# EAGLE design nedonand3 (EAGLE 5.12)
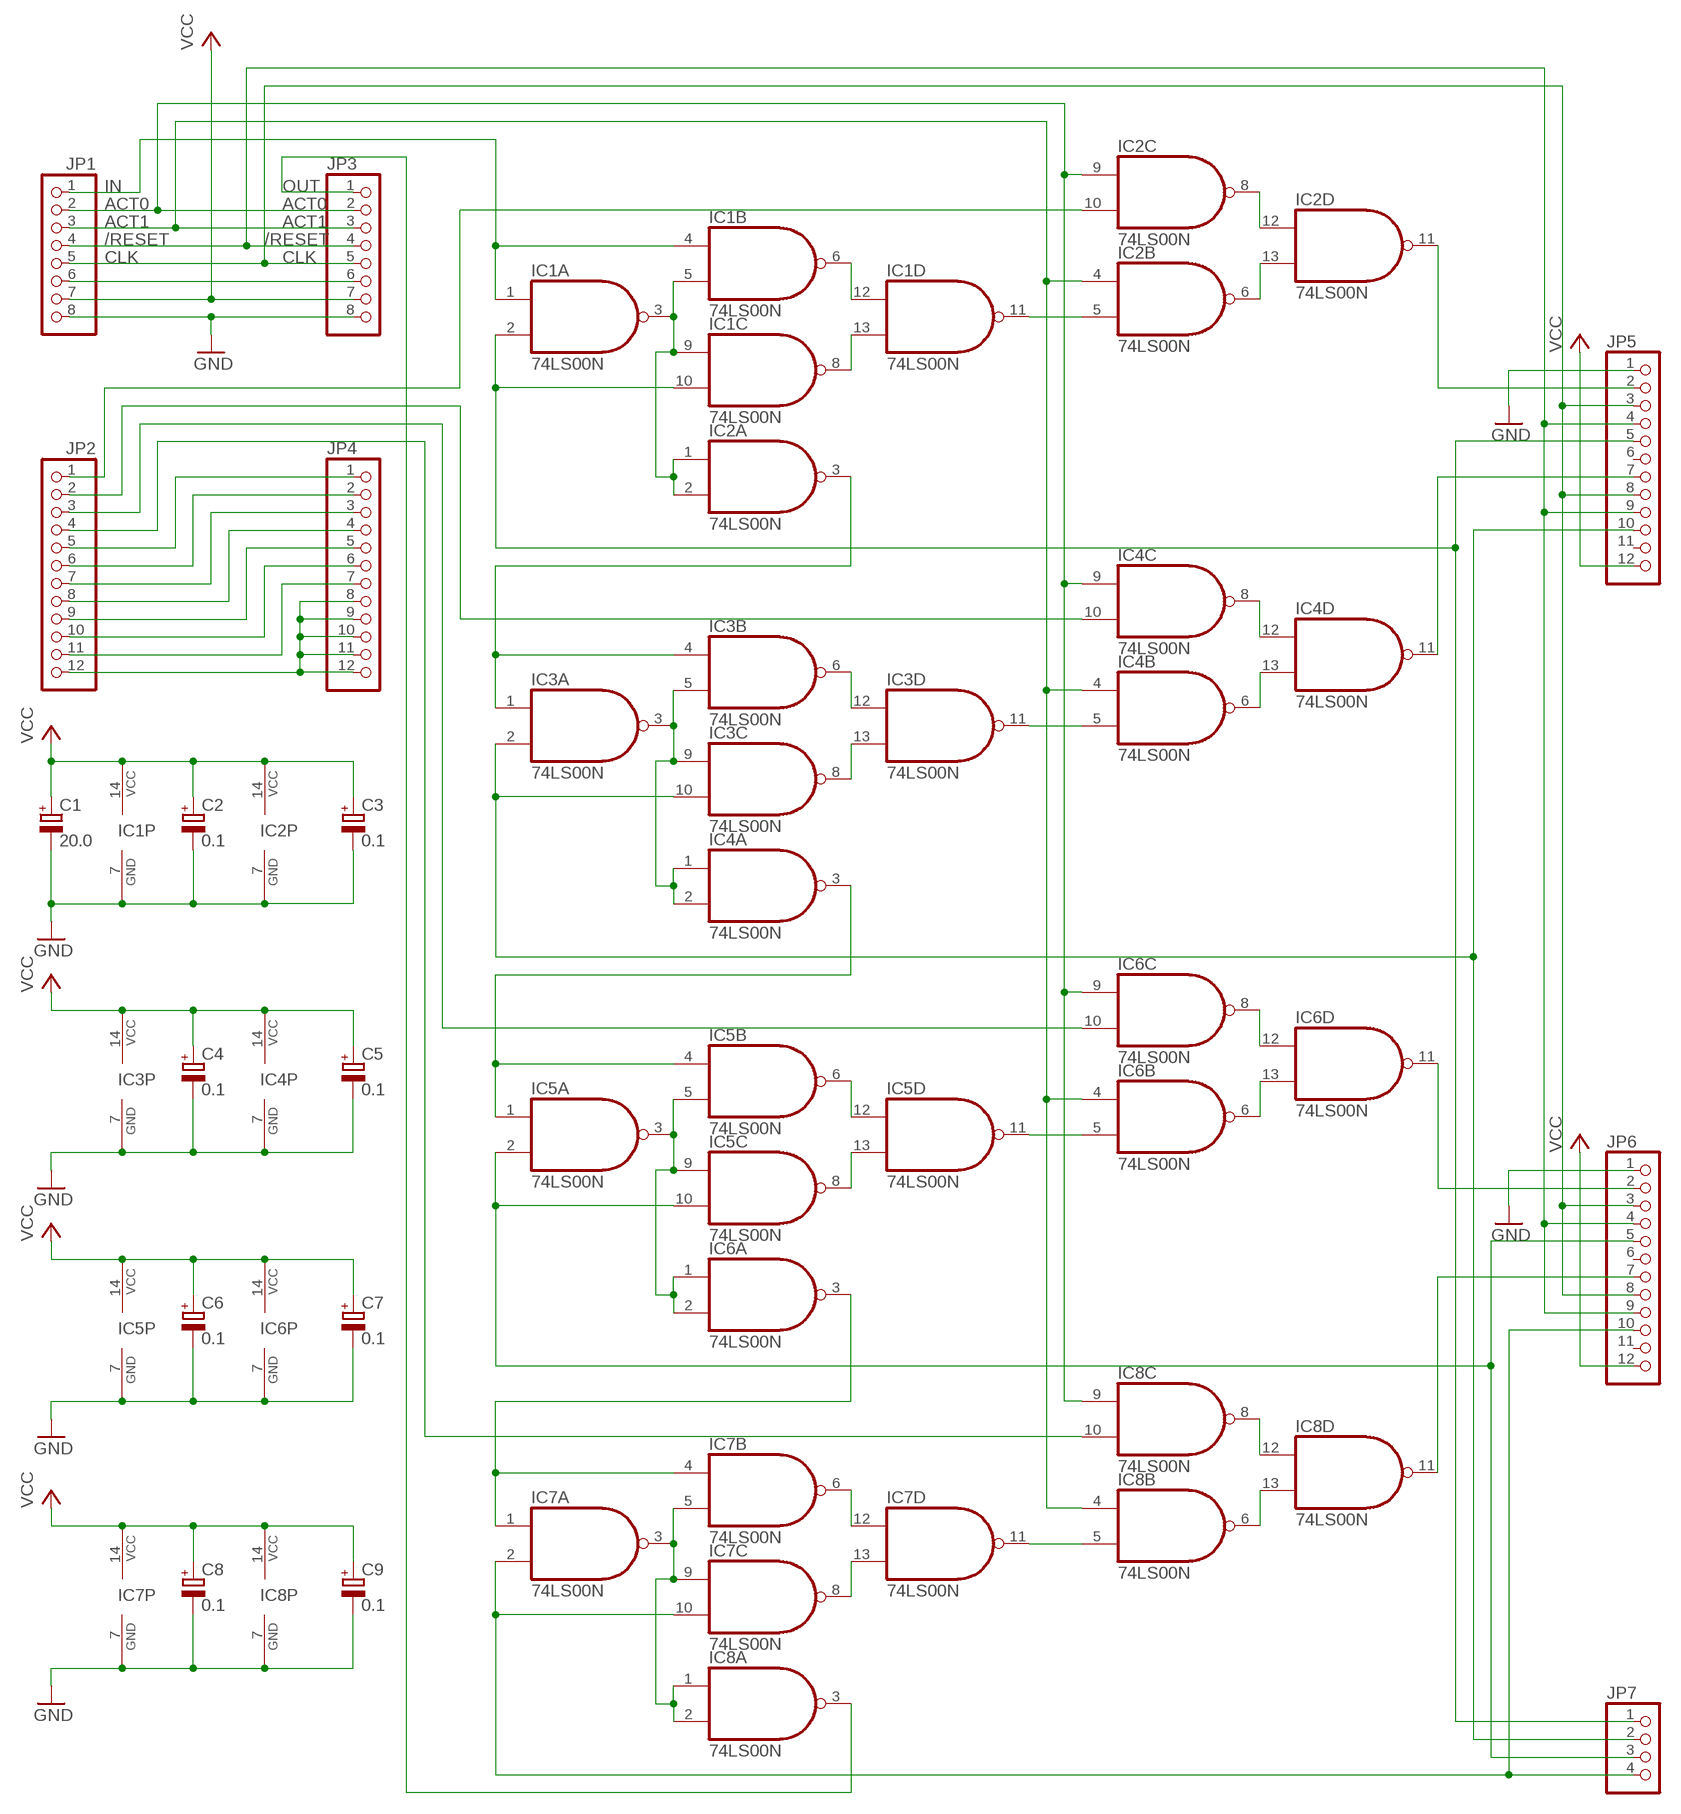
[diagram p0: schematic, sheet 1]

## Parts
C1  20.0  CPOL-EUE2,5-6E  [E2,5-6E]
C2  0.1  CPOL-EUB45181A  [B45181A]
C3  0.1  CPOL-EUB45181A  [B45181A]
C4  0.1  CPOL-EUB45181A  [B45181A]
C5  0.1  CPOL-EUB45181A  [B45181A]
C6  0.1  CPOL-EUB45181A  [B45181A]
C7  0.1  CPOL-EUB45181A  [B45181A]
C8  0.1  CPOL-EUB45181A  [B45181A]
C9  0.1  CPOL-EUB45181A  [B45181A]
IC1  74LS00N  [DIL14]
IC2  74LS00N  [DIL14]
IC3  74LS00N  [DIL14]
IC4  74LS00N  [DIL14]
IC5  74LS00N  [DIL14]
IC6  74LS00N  [DIL14]
IC7  74LS00N  [DIL14]
IC8  74LS00N  [DIL14]
JP1  PINHD-1X8/90  [1X08/90]
JP2  PINHD-1X12/90  [1X12/90]
JP3  PINHD-1X8  [1X08]
JP4  PINHD-1X12  [1X12]
JP5  PINHD-1X12  [1X12]
JP6  PINHD-1X12  [1X12]
JP7  PINHD-1X4  [1X04]

## Nets
/RESET: JP1.4 JP3.4 JP5.4 JP5.9 JP6.4 JP6.9
ACT0: IC2.9(C:I0) IC4.9(C:I0) IC6.9(C:I0) IC8.9(C:I0) JP1.2 JP3.2
ACT1: IC2.4(B:I0) IC4.4(B:I0) IC6.4(B:I0) IC8.4(B:I0) JP1.3 JP3.3
CLK: JP1.5 JP3.5 JP5.3 JP5.8 JP6.3 JP6.8
GND: C1.- C2.- C3.- C4.- C5.- C6.- C7.- C8.- C9.- IC1.7(P:GND) IC2.7(P:GND) IC3.7(P:GND) IC4.7(P:GND) IC5.7(P:GND) IC6.7(P:GND) IC7.7(P:GND) IC8.7(P:GND) JP1.8 JP3.8 JP5.1 JP6.1
IN: IC1.1(A:I0) IC1.4(B:I0) JP1.1
N$1: IC1.3(A:O) IC1.5(B:I1) IC1.9(C:I0) IC2.1(A:I0) IC2.2(A:I1)
N$2: IC1.2(A:I1) IC1.10(C:I1) JP5.5 JP7.1
N$3: IC3.3(A:O) IC3.5(B:I1) IC3.9(C:I0) IC4.1(A:I0) IC4.2(A:I1)
N$4: IC1.6(B:O) IC1.12(D:I0)
N$5: IC1.8(C:O) IC1.13(D:I1)
N$6: IC1.11(D:O) IC2.5(B:I1)
N$7: IC2.6(B:O) IC2.13(D:I1)
N$8: IC2.8(C:O) IC2.12(D:I0)
N$9: JP1.6 JP3.6
N$10: IC3.2(A:I1) IC3.10(C:I1) JP5.10 JP7.2
N$11: IC2.10(C:I1) JP2.1
N$12: IC3.6(B:O) IC3.12(D:I0)
N$13: IC3.8(C:O) IC3.13(D:I1)
N$14: IC4.10(C:I1) JP2.2
N$15: IC6.10(C:I1) JP2.3
N$16: IC8.10(C:I1) JP2.4
N$17: JP2.5 JP4.1
N$18: JP2.6 JP4.2
N$19: JP2.7 JP4.3
N$20: JP2.8 JP4.4
N$21: JP2.9 JP4.5
N$22: JP2.10 JP4.6
N$23: JP2.11 JP4.7
N$24: JP2.12 JP4.8 JP4.9 JP4.10 JP4.11 JP4.12
N$25: IC3.11(D:O) IC4.5(B:I1)
N$26: IC4.6(B:O) IC4.13(D:I1)
N$27: IC4.8(C:O) IC4.12(D:I0)
N$28: IC6.11(D:O) JP6.2
N$29: IC5.3(A:O) IC5.5(B:I1) IC5.9(C:I0) IC6.1(A:I0) IC6.2(A:I1)
N$30: IC5.2(A:I1) IC5.10(C:I1) JP6.5 JP7.3
N$31: IC5.6(B:O) IC5.12(D:I0)
N$32: IC5.8(C:O) IC5.13(D:I1)
N$33: IC5.11(D:O) IC6.5(B:I1)
N$34: IC6.6(B:O) IC6.13(D:I1)
N$35: IC6.8(C:O) IC6.12(D:I0)
N$36: IC2.11(D:O) JP5.2
N$37: IC7.3(A:O) IC7.5(B:I1) IC7.9(C:I0) IC8.1(A:I0) IC8.2(A:I1)
N$38: IC7.2(A:I1) IC7.10(C:I1) JP6.10 JP7.4
N$39: IC7.6(B:O) IC7.12(D:I0)
N$40: IC7.8(C:O) IC7.13(D:I1)
N$41: IC7.11(D:O) IC8.5(B:I1)
N$42: IC8.6(B:O) IC8.13(D:I1)
N$43: IC8.8(C:O) IC8.12(D:I0)
N$44: IC4.11(D:O) JP5.7
N$45: IC2.3(A:O) IC3.1(A:I0) IC3.4(B:I0)
N$46: IC8.11(D:O) JP6.7
N$47: IC4.3(A:O) IC5.1(A:I0) IC5.4(B:I0)
N$48: IC6.3(A:O) IC7.1(A:I0) IC7.4(B:I0)
OUT: IC8.3(A:O) JP3.1
VCC: C1.+ C2.+ C3.+ C4.+ C5.+ C6.+ C7.+ C8.+ C9.+ IC1.14(P:VCC) IC2.14(P:VCC) IC3.14(P:VCC) IC4.14(P:VCC) IC5.14(P:VCC) IC6.14(P:VCC) IC7.14(P:VCC) IC8.14(P:VCC) JP1.7 JP3.7 JP5.12 JP6.12
Unconnected: JP5.6 JP5.11 JP6.6 JP6.11

## Library data of the parts
C1-C9 = rcl:CPOL-EU: POLARIZED CAPACITOR, European symbol
IC1-IC8 = 74xx-us:74*00: Quad 2-input NAND gate
JP1 JP3 = pinhead:PINHD-1X8: PIN HEADER
JP2 JP4-JP6 = pinhead:PINHD-1X12: PIN HEADER
JP7 = pinhead:PINHD-1X4: PIN HEADER

## Board
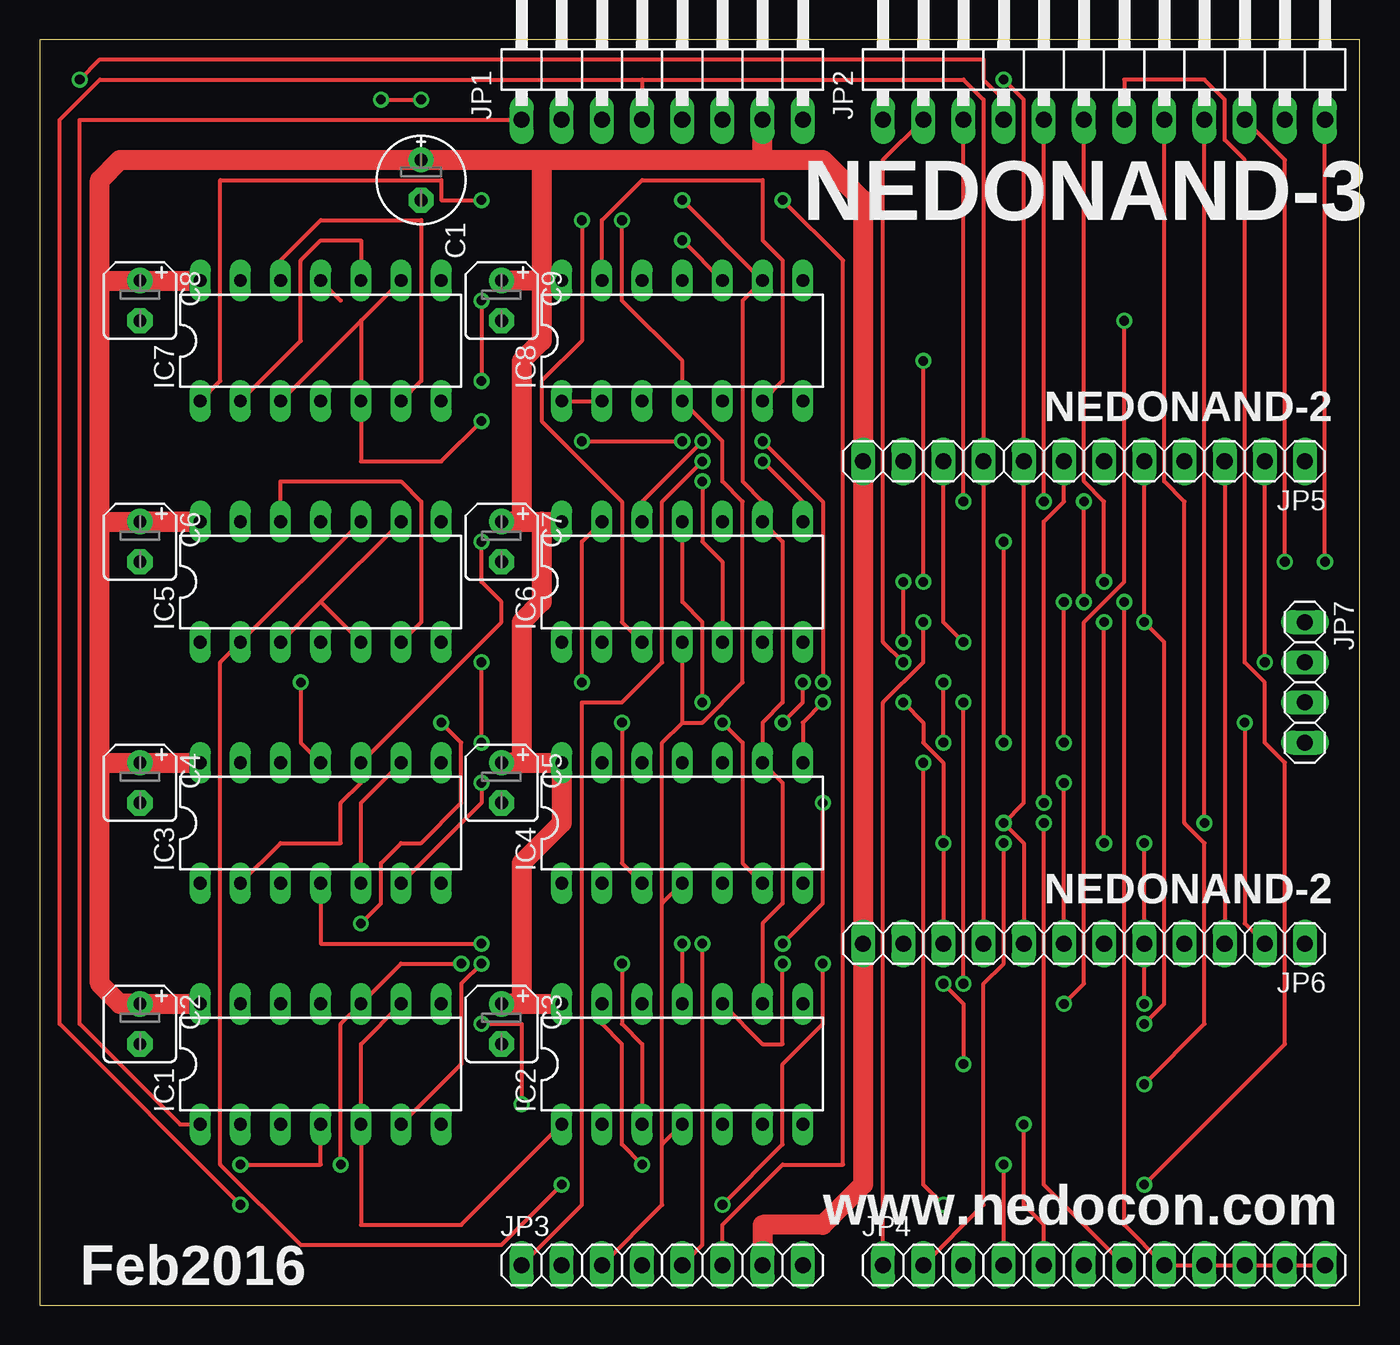
[diagram p1: board, top side]
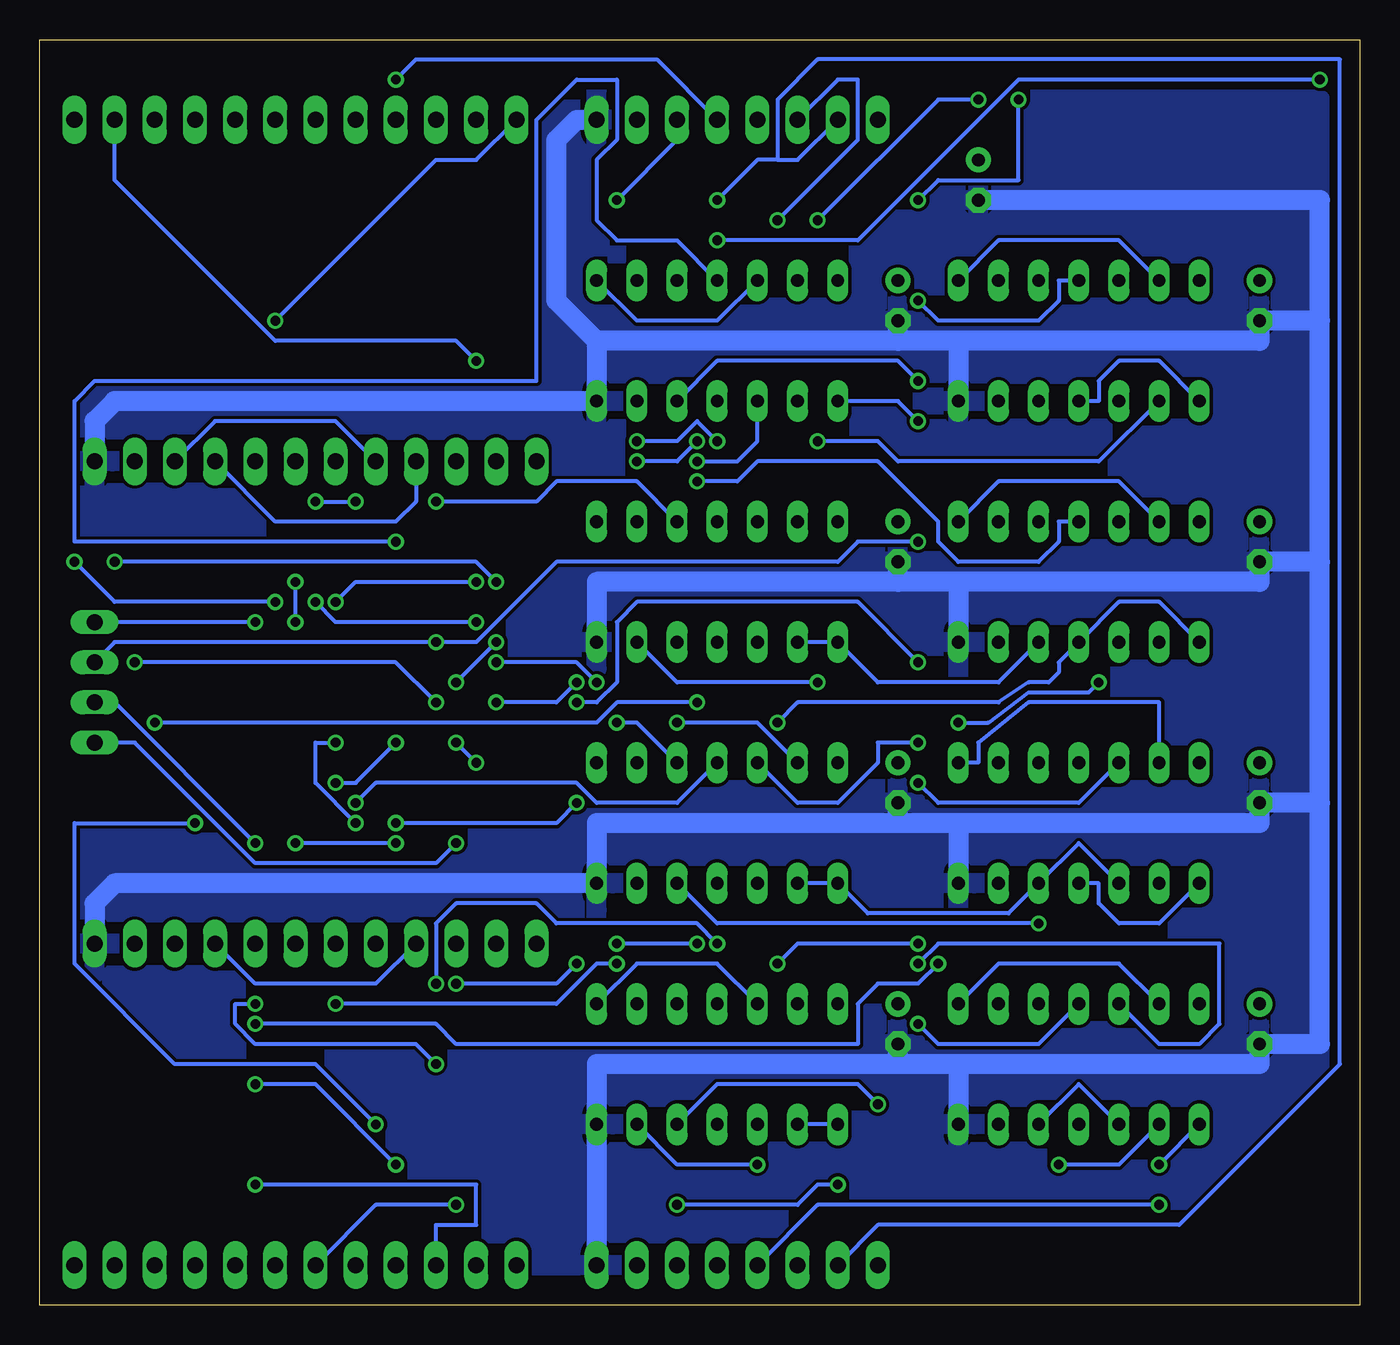
[diagram p2: board, bottom side, seen from below]

Size 83.49 x 80 mm. Coordinates in mm from the lower left corner, seen from the top.
Outline: 0,0 83.49,0 83.49,80 0,80 0,0
Copper layers (1*16): Top 0.035mm / dielectric 1.5mm / Bottom 0.035mm
Design rules "default *": minimum track width 10mil, minimum drill 20mil, track to track 8mil, track to pad 8mil, pad to pad 8mil, via to via 8mil, smd to smd 8mil, copper to edge 40mil, drill to drill 8mil, minimum pad ring 10mil, minimum via ring 8mil, stop-mask expansion 4mil, vias tented up to drill 0mil, thermal gap 10mil

### Footprints (pad centres in the part's own frame; a part is rotated, then mirrored left to right if it is on the bottom)
E2,5-6E = drill 0.813 pad 1.575 round: + -1.27,0 | drill 0.813 pad 1.575 octagon: - 1.27,0
B45181A = drill 0.813 pad 1.6 round: + -1.27,0 | drill 0.813 pad 1.6 octagon: - 1.27,0
DIL14 = drill 0.813 long: 1 -7.62,-3.81; 2 -5.08,-3.81; 3 -2.54,-3.81; 4 0,-3.81; 5 2.54,-3.81; 6 5.08,-3.81; 7 7.62,-3.81; 8 7.62,3.81; 9 5.08,3.81; 10 2.54,3.81; 11 0,3.81; 12 -2.54,3.81; 13 -5.08,3.81; 14 -7.62,3.81
1X08/90 = drill 1.016 long: 1 -8.89,-3.81; 2 -6.35,-3.81; 3 -3.81,-3.81; 4 -1.27,-3.81; 5 1.27,-3.81; 6 3.81,-3.81; 7 6.35,-3.81; 8 8.89,-3.81
1X12/90 = drill 1.016 long: 1 -13.97,-3.81; 2 -11.43,-3.81; 3 -8.89,-3.81; 4 -6.35,-3.81; 5 -3.81,-3.81; 6 -1.27,-3.81; 7 1.27,-3.81; 8 3.81,-3.81; 9 6.35,-3.81; 10 8.89,-3.81; 11 11.43,-3.81; 12 13.97,-3.81
1X08 = drill 1.016 long: 1 -8.89,0; 2 -6.35,0; 3 -3.81,0; 4 -1.27,0; 5 1.27,0; 6 3.81,0; 7 6.35,0; 8 8.89,0
1X12 = drill 1.016 long: 1 -13.97,0; 2 -11.43,0; 3 -8.89,0; 4 -6.35,0; 5 -3.81,0; 6 -1.27,0; 7 1.27,0; 8 3.81,0; 9 6.35,0; 10 8.89,0; 11 11.43,0; 12 13.97,0
1X04 = drill 1.016 long: 1 -3.81,0; 2 -1.27,0; 3 1.27,0; 4 3.81,0

### Placement (x,y rotation side)
C1  24.13,71.12 270 top
C2  6.35,17.78 270 top
C3  29.21,17.78 270 top
C4  6.35,33.02 270 top
C5  29.21,33.02 270 top
C6  6.35,48.26 270 top
C7  29.21,48.26 270 top
C8  6.35,63.5 270 top
C9  29.21,63.5 270 top
IC1  17.78,15.24 0 top
IC2  40.64,15.24 0 top
IC3  17.78,30.48 0 top
IC4  40.64,30.48 0 top
IC5  17.78,45.72 0 top
IC6  40.64,45.72 0 top
IC7  17.78,60.96 0 top
IC8  40.64,60.96 0 top
JP1  39.37,78.74 0 top
JP2  67.31,78.74 0 top
JP3  39.37,2.54 0 top
JP4  67.31,2.54 0 top
JP5  66.04,53.34 180 top
JP6  66.04,22.86 180 top
JP7  80.01,39.37 270 top

### Tracks (layer width: path | path; a pad name or v marks a point on that pad's centre or on a via)
/RESET  (via drill 0.61)
  Top 0.254: JP6.9 JP5.9 59.69,76.2 58.42,77.47 38.1,77.47 | v12.7,6.35 1.27,17.78 1.27,74.93 3.81,77.47 38.1,77.47 | 38.1,77.47 JP1.4
  Bottom 0.254: JP6.4 69.85,20.32 62.23,20.32 JP6.9 | JP5.4 68.58,49.53 60.96,49.53 59.69,50.8 JP5.9 | JP3.4 34.29,6.35 v12.7,6.35
ACT0  (via drill 0.61)
  Top 0.254: v40.64,69.85 IC8.9 44.45,63.5 44.45,52.07 45.72,50.8 IC6.9 46.99,48.26 46.99,38.1 45.72,36.83 IC4.9 46.99,33.02 46.99,25.4 45.72,24.13 IC2.9
  Bottom 0.254: JP3.2 30.48,5.08 11.43,5.08 1.27,15.24 1.27,78.74 34.29,78.74 36.83,76.2 36.83,72.39 | 36.83,72.39 35.56,72.39 JP1.2 | v40.64,69.85 38.1,72.39 36.83,72.39
ACT1  (via drill 0.61)
  Top 0.254: v36.83,68.58 36.83,63.5 40.64,59.69 IC8.4 43.18,54.61 43.18,52.07 44.45,50.8 44.45,39.37 41.91,36.83 40.64,36.83 | 39.37,10.16 IC2.4 | 39.37,10.16 39.37,6.35 JP3.3 | 39.37,25.4 IC4.4 | 39.37,10.16 39.37,25.4 | 40.64,36.83 IC6.4 | 40.64,36.83 39.37,35.56 39.37,25.4
  Bottom 0.254: v36.83,68.58 31.75,73.66 31.75,77.47 33.02,77.47 JP1.3
CLK  (via drill 0.61)
  Top 0.254: JP3.5 41.91,3.81 v41.91,22.86 | v46.99,22.86 49.53,25.4 v49.53,31.75 | JP6.8 62.23,29.21 v60.96,30.48 62.23,31.75 JP5.8 62.23,76.2 v60.96,77.47 | JP5.3 JP6.3
  Bottom 0.254: v41.91,22.86 v46.99,22.86 | v49.53,31.75 50.8,30.48 v60.96,30.48 | JP1.5 44.45,78.74 59.69,78.74 v60.96,77.47 | JP5.3 72.39,55.88 64.77,55.88 JP5.8
GND
  Bottom 1.27: 2.54,62.23 C8.- 6.35,60.96 25.4,60.96 | 2.54,62.23 2.54,69.85 C1.- | 2.54,46.99 C6.- 6.35,45.72 25.4,45.72 | 2.54,46.99 2.54,62.23 | 2.54,31.75 C4.- 6.35,30.48 25.4,30.48 | 2.54,31.75 2.54,46.99 | 2.54,31.75 2.54,16.51 C2.- 6.35,15.24 25.4,15.24 | 29.21,60.96 C9.- | 25.4,60.96 29.21,60.96 | 48.26,60.96 IC8.7 78.74,57.15 80.01,55.88 JP5.1 | 29.21,60.96 48.26,60.96 | 25.4,60.96 IC7.7 | IC6.7 48.26,45.72 29.21,45.72 | 29.21,45.72 C7.- | 25.4,45.72 29.21,45.72 | 25.4,45.72 IC5.7 | 25.4,30.48 29.21,30.48 | 29.21,30.48 48.26,30.48 IC4.7 78.74,26.67 80.01,25.4 JP6.1 | 25.4,30.48 IC3.7 | 25.4,15.24 29.21,15.24 | 29.21,15.24 48.26,15.24 IC2.7 JP3.8 | 29.21,15.24 C3.- | 25.4,15.24 IC1.7 | JP1.8 49.53,74.93 50.8,73.66 50.8,63.5 48.26,60.96 | 29.21,30.48 C5.-
  pour Bottom: 2.54,76.2 78.74,76.2 81.28,73.66 81.28,5.08 78.74,2.54 5.08,2.54 2.54,5.08
IN  (via drill 0.61)
  Top 0.254: v12.7,8.89 17.78,8.89 IC1.4 | JP1.1 2.54,74.93 2.54,17.78 8.89,11.43 IC1.1
  Bottom 0.254: IC1.1 v12.7,8.89
N$1
  Top 0.254: IC1.9 20.32,16.51 IC1.5 20.32,5.08 26.67,5.08 IC2.1
  Bottom 0.254: IC2.1 IC2.2 | IC1.3 17.78,13.97 IC1.5
N$2  (via drill 0.61)
  Top 0.254: v19.05,8.89 19.05,17.78 IC1.10 22.86,21.59 v26.67,21.59 | JP5.5 v69.85,43.18 71.12,41.91 71.12,19.05 v69.85,17.78
  Bottom 0.254: IC1.2 15.24,8.89 v19.05,8.89 | v69.85,43.18 JP7.1 | v26.67,21.59 27.94,20.32 30.48,20.32 31.75,19.05 31.75,16.51 57.15,16.51 58.42,17.78 v69.85,17.78
N$3
  Top 0.254: IC3.9 20.32,31.75 IC3.5
  Bottom 0.254: IC4.2 IC4.1 31.11,24.77 22.23,24.77 IC3.5 17.78,29.21 IC3.3
N$4  (via drill 0.61)
  Top 0.254: v27.94,21.59 26.67,20.32 26.67,15.24 IC1.6
  Bottom 0.254: IC1.12 12.7,16.51 10.16,16.51 8.89,17.78 8.89,22.86 26.67,22.86 v27.94,21.59
N$5
  Bottom 0.254: IC1.13 15.24,21.59 22.86,21.59 IC1.8
N$6  (via drill 0.61)
  Top 0.254: v27.94,17.78 30.48,17.78 v30.48,12.7
  Bottom 0.254: IC1.11 20.32,16.51 26.67,16.51 v27.94,17.78 | v30.48,12.7 31.75,13.97 40.64,13.97 IC2.5
N$7  (via drill 0.61)
  Top 0.254: v38.1,8.89 36.83,10.16 36.83,16.51 35.56,17.78 IC2.13
  Bottom 0.254: IC2.6 43.18,8.89 v38.1,8.89
N$8
  Bottom 0.254: IC2.12 40.64,21.59 45.72,21.59 IC2.8
N$9  (via drill 0.61)
  Top 0.254: JP3.6 43.18,5.08 46.99,8.89 50.8,8.89 50.8,66.04 v46.99,69.85
  Bottom 0.254: v46.99,69.85 43.18,73.66 JP1.6
N$10  (via drill 0.61)
  Top 0.254: v58.42,41.91 57.15,43.18 JP5.10 | v27.94,48.26 27.94,45.72 29.21,44.45 29.21,43.18 IC3.10 20.32,33.02 19.05,31.75 19.05,29.21 15.24,29.21 IC3.2
  Bottom 0.254: JP7.2 78.74,41.91 v58.42,41.91 55.88,41.91 50.8,46.99 33.02,46.99 31.75,48.26 v27.94,48.26
N$11  (via drill 0.61)
  Top 0.254: IC2.10 45.72,16.51 46.99,16.51 v46.99,21.59 | v64.77,19.05 66.04,20.32 66.04,43.18 68.58,45.72 v68.58,62.23
  Bottom 0.254: v46.99,21.59 48.26,21.59 50.8,19.05 v64.77,19.05 | v68.58,62.23 58.42,72.39 55.88,72.39 JP2.1
N$12  (via drill 0.61)
  Top 0.254: IC3.6 27.94,31.75 v27.94,33.02
  Bottom 0.254: v27.94,33.02 26.67,31.75 17.78,31.75 IC3.12
N$13
  Bottom 0.254: IC3.13 12.7,38.1 20.95,38.1 24.13,35.56 24.13,34.29 IC3.8
N$14  (via drill 0.61)
  Top 0.254: v46.99,36.83 48.26,38.1 v48.26,39.37 | v54.61,40.64 53.34,41.91 53.34,72.39 JP2.2
  Bottom 0.254: IC4.10 45.72,36.83 v46.99,36.83 | v48.26,39.37 49.53,40.64 v54.61,40.64
N$15  (via drill 0.61)
  Top 0.254: v58.42,50.8 JP2.3
  Bottom 0.254: IC6.10 45.72,52.07 50.8,52.07 52.07,50.8 v58.42,50.8
N$16  (via drill 0.61)
  Top 0.254: v40.64,67.31 IC8.10 | v2.54,77.47 3.81,78.74 59.69,78.74 59.69,77.47 60.96,76.2 JP2.4
  Bottom 0.254: v40.64,67.31 31.75,67.31 21.59,77.47 v2.54,77.47
N$17  (via drill 0.61)
  Top 0.254: JP4.1 53.34,38.1 55.88,40.64 v55.88,43.18 | v66.04,44.45 v66.04,50.8 | v63.5,50.8 JP2.5
  Bottom 0.254: v55.88,43.18 64.77,43.18 v66.04,44.45 | v66.04,50.8 v63.5,50.8
N$18  (via drill 0.61)
  Top 0.254: JP4.2 59.69,6.35 59.69,20.32 60.96,21.59 v60.96,29.21 | v67.31,29.21 v67.31,43.18 | v67.31,45.72 67.31,50.8 66.04,52.07 JP2.6
  Bottom 0.254: v60.96,29.21 v67.31,29.21 | v67.31,43.18 v67.31,45.72
N$19  (via drill 0.61)
  Top 0.254: v69.85,7.62 78.74,16.51 78.74,34.29 77.47,35.56 77.47,39.37 76.2,40.64 76.2,72.39 74.93,73.66 74.93,76.2 73.66,77.47 68.58,77.47 JP2.7
  Bottom 0.254: JP4.3 58.42,5.08 55.88,5.08 55.88,7.62 v69.85,7.62
N$20  (via drill 0.61)
  Top 0.254: JP4.4 v60.96,8.89 | v69.85,13.97 73.66,17.78 73.66,29.21 72.39,30.48 72.39,50.8 71.12,52.07 JP2.8
  Bottom 0.254: v60.96,8.89 66.04,13.97 v69.85,13.97
N$21  (via drill 0.61)
  Top 0.254: JP4.5 63.5,5.08 62.23,6.35 v62.23,11.43 | v73.66,30.48 JP2.9
  Bottom 0.254: v62.23,11.43 66.04,15.24 74.93,15.24 81.28,21.59 81.28,30.48 v73.66,30.48
N$22  (via drill 0.61)
  Top 0.254: v57.15,6.35 55.88,7.62 v55.88,34.29 | v57.15,35.56 v57.15,39.37 | v54.61,41.91 v54.61,45.72 | v78.74,46.99 78.74,72.39 JP2.10
  Bottom 0.254: JP4.6 62.23,6.35 v57.15,6.35 | v55.88,34.29 v57.15,35.56 | v57.15,39.37 v54.61,41.91 | v54.61,45.72 55.88,46.99 v78.74,46.99
N$23  (via drill 0.61)
  Top 0.254: JP4.7 63.5,7.62 v63.5,30.48 | v64.77,35.56 v64.77,44.45 | v55.88,45.72 v55.88,59.69
  Bottom 0.254: v63.5,30.48 66.04,33.02 66.04,35.56 v64.77,35.56 | v64.77,44.45 63.5,45.72 v55.88,45.72 | v55.88,59.69 57.15,60.96 68.58,60.96 78.74,71.12 JP2.11
N$24  (via drill 0.61)
  Top 0.254: JP4.12 JP4.11 JP4.10 JP4.9 JP4.8 68.58,5.08 v68.58,44.45 | v81.28,46.99 JP2.12
  Bottom 0.254: v81.28,46.99 78.74,44.45 v68.58,44.45
N$25  (via drill 0.6)
  Top 0.254: v25.4,36.83 26.67,35.56 26.67,31.75 24.13,29.21 22.86,29.21 21.59,27.94 21.59,25.4 v20.32,24.13 | v16.51,39.37 16.51,35.56 IC3.11
  Bottom 0.254: v20.32,24.13 40.64,24.13 IC4.5 | v25.4,36.83 23.5,36.83 20.95,38.73 17.14,38.73 v16.51,39.37
N$26  (via drill 0.61)
  Top 0.254: v43.18,36.83 44.45,35.56 44.45,27.94 IC4.6
  Bottom 0.254: IC4.13 38.1,36.83 v43.18,36.83
N$27  (via drill 0.61)
  Top 0.254: v27.94,35.56 v27.94,40.64 | v49.53,38.1 48.26,36.83 IC4.8
  Bottom 0.254: IC4.12 35.56,31.75 33.02,31.75 30.48,34.29 30.48,35.56 v27.94,35.56 | v27.94,40.64 31.75,44.45 45.72,44.45 46.99,43.18 46.99,39.37 48.26,38.1 v49.53,38.1
N$28  (via drill 0.61)
  Top 0.254: IC6.11 40.64,44.45 41.91,43.18 v41.91,38.1 | v76.2,36.83 76.2,24.13 JP6.2
  Bottom 0.254: v41.91,38.1 46.99,38.1 48.26,36.83 v76.2,36.83
N$29
  Top 0.254: 17.78,44.45 IC5.9 | IC5.3 17.78,44.45 | 17.78,44.45 IC5.5
  Bottom 0.254: IC6.2 IC6.1 30.48,39.37 22.86,39.37 IC5.5
N$30  (via drill 0.61)
  Top 0.254: IC5.10 IC5.2 11.43,40.64 11.43,8.89 16.51,3.81 29.21,3.81 v33.02,7.62 | v69.85,29.21 JP6.5 v69.85,19.05 | v43.18,6.35 46.99,10.16 46.99,15.24 49.53,17.78 v49.53,21.59 | v57.15,20.32 58.42,19.05 v58.42,15.24
  Bottom 0.254: v69.85,29.21 78.74,38.1 JP7.3 | v33.02,7.62 34.29,7.62 35.56,6.35 v43.18,6.35 | v49.53,21.59 50.8,20.32 v57.15,20.32 | v58.42,15.24 59.69,16.51 69.85,16.51 71.12,17.78 71.12,19.05 v69.85,19.05
N$31
  Top 0.254: IC5.6 24.13,43.18 24.13,50.8 22.86,52.07 15.24,52.07 IC5.12
N$32
  Bottom 0.254: IC5.13 15.24,52.07 22.86,52.07 IC5.8
N$33  (via drill 0.61)
  Top 0.254: IC6.5 43.18,46.99 41.91,48.26 v41.91,52.07
  Bottom 0.254: v41.91,52.07 39.37,52.07 38.1,53.34 30.48,53.34 26.67,49.53 26.67,48.26 25.4,46.99 20.32,46.99 19.05,48.26 19.05,49.53 IC5.11
N$34  (via drill 0.61)
  Top 0.254: IC6.13 34.29,48.26 v34.29,39.37
  Bottom 0.254: IC6.6 43.18,39.37 v34.29,39.37
N$35  (via drill 0.61)
  Top 0.254: IC6.12 38.1,50.8 v41.91,54.61 | v45.72,53.34 48.26,50.8 IC6.8
  Bottom 0.254: v41.91,54.61 43.18,53.34 v45.72,53.34
N$36  (via drill 0.61)
  Top 0.254: IC2.11 v40.64,22.86 | v58.42,20.32 v58.42,38.1 | v77.47,40.64 JP5.2
  Bottom 0.254: v40.64,22.86 41.91,24.13 50.8,24.13 52.07,25.4 57.15,25.4 58.42,24.13 v58.42,20.32 | v58.42,38.1 60.96,40.64 v77.47,40.64
N$37  (via drill 0.61)
  Top 0.254: 20.32,62.23 IC7.9 | 20.32,62.23 IC7.5 20.32,53.34 25.4,53.34 v27.94,55.88 | IC8.1 IC8.2 | IC7.3 20.32,62.23
  Bottom 0.254: IC8.1 29.21,57.15 v27.94,55.88
N$38  (via drill 0.61)
  Top 0.254: IC7.2 16.51,60.96 16.51,66.04 17.78,67.31 20.32,67.31 IC7.10 | JP6.10 v57.15,29.21 57.15,34.29 55.88,35.56 55.88,36.83 v54.61,38.1 | v34.29,54.61 v40.64,54.61 | v45.72,54.61 49.53,50.8 v49.53,39.37
  Bottom 0.254: v57.15,29.21 58.42,27.94 69.85,27.94 77.47,35.56 JP7.4 | IC7.2 16.51,53.34 29.21,53.34 30.48,54.61 v34.29,54.61 | v40.64,54.61 41.91,55.88 43.18,54.61 v45.72,54.61 | v49.53,39.37 50.8,38.1 v54.61,38.1
N$39
  Top 0.254: IC7.12 15.24,66.04 17.78,68.58 24.13,68.58 24.13,58.42 IC7.6
N$40
  Bottom 0.254: IC7.13 15.24,67.31 22.86,67.31 IC7.8
N$41  (via drill 0.61)
  Top 0.254: IC7.11 19.05,63.5 | v27.94,63.5 v27.94,58.42
  Bottom 0.254: IC8.5 40.64,59.69 29.21,59.69 v27.94,58.42 | v27.94,63.5 26.67,62.23 20.32,62.23 19.05,63.5 19.05,64.77 IC7.11
N$42
  Top 0.254: IC8.13 35.56,68.58 38.1,71.12 45.72,71.12 45.72,67.31 46.99,66.04 46.99,58.42 IC8.6
N$43
  Bottom 0.254: IC8.12 40.64,62.23 45.72,62.23 IC8.8
N$44  (via drill 0.61)
  Top 0.254: v63.5,31.75 63.5,49.53 64.77,50.8 JP5.7
  Bottom 0.254: IC4.11 43.18,31.75 48.26,31.75 49.53,33.02 62.23,33.02 v63.5,31.75
N$45  (via drill 0.61)
  Top 0.254: IC2.3 38.1,16.51 36.83,17.78 v36.83,21.59 | v27.94,22.86 17.78,22.86 IC3.4
  Bottom 0.254: IC3.1 12.7,24.13 15.24,24.13 16.51,25.4 16.51,26.67 IC3.4 | v36.83,21.59 35.56,22.86 v27.94,22.86
N$46  (via drill 0.61)
  Top 0.254: v60.96,35.56 v60.96,48.26 | JP6.7 v64.77,33.02
  Bottom 0.254: IC8.11 43.18,67.31 46.99,67.31 48.26,68.58 48.26,72.39 46.99,73.66 46.99,77.47 49.53,77.47 52.07,74.93 52.07,58.42 80.01,58.42 81.28,57.15 81.28,48.26 v60.96,48.26 | v60.96,35.56 63.5,33.02 v64.77,33.02
N$47  (via drill 0.61)
  Top 0.254: IC4.3 36.83,27.94 v36.83,36.83
  Bottom 0.254: IC5.1 12.7,44.45 15.24,44.45 IC5.4 19.05,40.64 19.05,40.01 19.68,39.37 20.95,39.37 22.86,38.1 35.56,38.1 v36.83,36.83
N$48  (via drill 0.61)
  Top 0.254: IC6.3 36.83,43.18 36.83,50.8 31.75,55.88 31.75,58.42 34.29,60.96 v34.29,68.58 | v21.59,76.2 v24.13,76.2 | v27.94,69.85 25.4,69.85 25.4,71.12 11.43,71.12 11.43,58.42 IC7.1
  Bottom 0.254: IC7.1 12.7,59.69 15.24,59.69 16.51,58.42 16.51,57.15 IC7.4 | v34.29,68.58 26.67,76.2 v24.13,76.2 | v21.59,76.2 21.59,71.12 26.67,71.12 v27.94,69.85
OUT  (via drill 0.61)
  Top 0.254: JP3.1 34.29,6.35 34.29,38.1 36.83,38.1 39.37,40.64 39.37,50.8 v41.91,53.34
  Bottom 0.254: IC8.3 38.1,54.61 39.37,53.34 v41.91,53.34
VCC
  Top 1.27: IC7.14 C8.+ 3.81,64.77 | C6.+ IC5.14 3.81,49.53 | IC3.14 C4.+ 3.81,34.29 | IC1.14 C2.+ 5.08,19.05 3.81,20.32 3.81,34.29 | 31.75,64.77 C9.+ | 31.75,64.77 IC8.14 | 30.48,49.53 C7.+ | 30.48,34.29 C5.+ | 30.48,19.05 C3.+ | 3.81,34.29 3.81,49.53 | 3.81,49.53 3.81,64.77 | 3.81,64.77 3.81,71.12 5.08,72.39 C1.+ 31.75,72.39 | 30.48,49.53 31.75,49.53 | 31.75,49.53 IC6.14 | 30.48,49.53 30.48,59.69 31.75,60.96 31.75,64.77 | 30.48,34.29 IC4.14 33.02,30.48 30.48,27.94 30.48,19.05 | 30.48,34.29 30.48,43.18 31.75,44.45 31.75,49.53 | 30.48,19.05 IC2.14 | 31.75,72.39 45.72,72.39 | 45.72,72.39 49.53,72.39 52.07,69.85 JP5.12 JP6.12 52.07,7.62 49.53,5.08 45.72,5.08 JP3.7 | 31.75,72.39 31.75,64.77 | 45.72,72.39 JP1.7

### Text on the board
tNames: NEDONAND-3 | NEDONAND-2 | NEDONAND-2 | www.nedocon.com | Feb2016